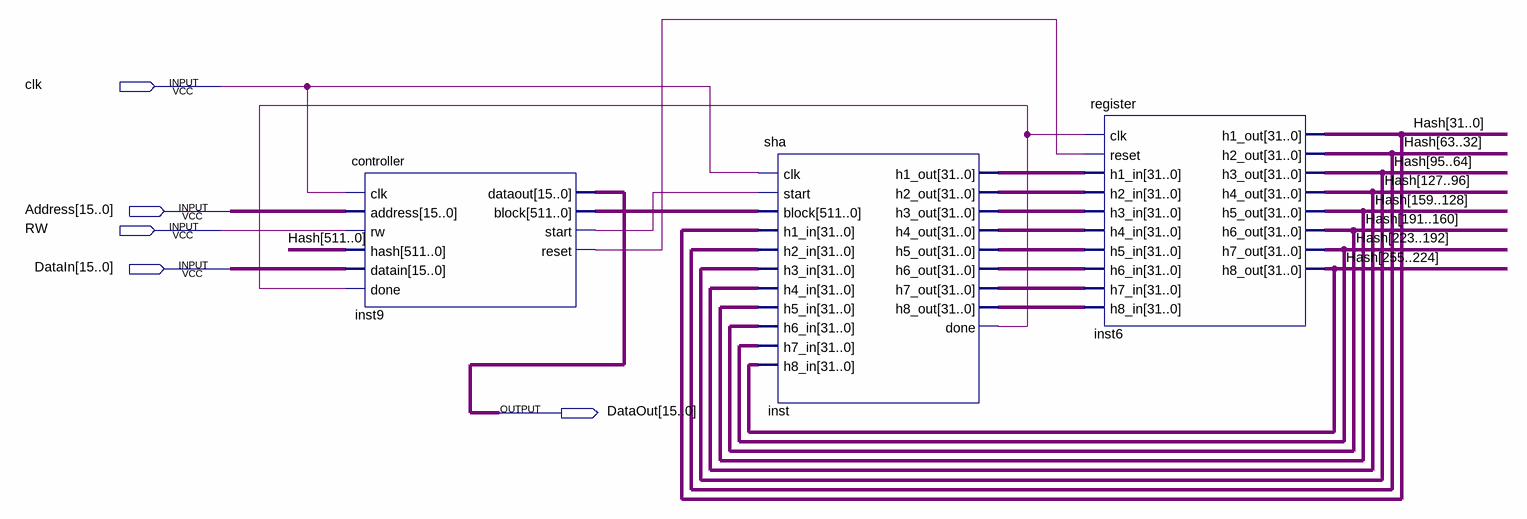
[diagram p0: schematic sheet]
// Quartus schematic sha_block.bdf as structural Verilog: 3 symbols, 5 pins
module sha_block (
  input  clk,
  input  [15:0] Address,
  input  RW,
  input  [15:0] DataIn,
  output [15:0] DataOut
);

  wire inst9_reset, inst9_start, inst_done;
  wire [31:0] inst_h1_out, inst_h2_out, inst_h3_out, inst_h4_out, inst_h5_out, inst_h6_out, inst_h7_out,
       inst_h8_out;
  wire [511:0] Hash, inst9_block;

  controller inst9 (
    .clk(clk), .address(Address), .rw(RW), .hash(Hash), .datain(DataIn), .done(inst_done), .dataout(DataOut),
    .block(inst9_block), .start(inst9_start), .reset(inst9_reset));
  sha inst (
    .clk(clk), .start(inst9_start), .block(inst9_block), .h1_in(Hash[31:0]), .h2_in(Hash[63:32]),
    .h3_in(Hash[95:64]), .h4_in(Hash[127:96]), .h5_in(Hash[159:128]), .h6_in(Hash[191:160]),
    .h7_in(Hash[223:192]), .h8_in(Hash[255:224]), .h1_out(inst_h1_out), .h2_out(inst_h2_out),
    .h3_out(inst_h3_out), .h4_out(inst_h4_out), .h5_out(inst_h5_out), .h6_out(inst_h6_out),
    .h7_out(inst_h7_out), .h8_out(inst_h8_out), .done(inst_done));
  register inst6 (
    .clk(inst_done), .reset(inst9_reset), .h1_in(inst_h1_out), .h2_in(inst_h2_out), .h3_in(inst_h3_out),
    .h4_in(inst_h4_out), .h5_in(inst_h5_out), .h6_in(inst_h6_out), .h7_in(inst_h7_out), .h8_in(inst_h8_out),
    .h1_out(Hash[31:0]), .h2_out(Hash[63:32]), .h3_out(Hash[95:64]), .h4_out(Hash[127:96]),
    .h5_out(Hash[159:128]), .h6_out(Hash[191:160]), .h7_out(Hash[223:192]), .h8_out(Hash[255:224]));
endmodule
